# Altium schematic sheet IR-Detector.SchDoc
size A; SheetNumber: 15; SheetTotal: 15
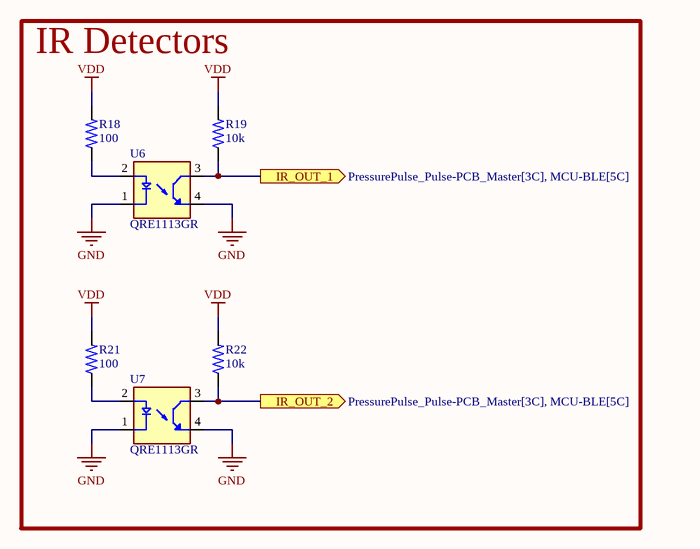
[diagram p0: IR-Detector.SchDoc]

## Parts
R18  value 100  [0402R]  (hidden comment: RES)
R19  value 10k  [0402R]  (hidden comment: RES)
R21  value 100  [0402R]  (hidden comment: RES)
R22  value 10k  [0402R]  (hidden comment: RES)
U6  QRE1113GR  [SMD-4P]
U7  QRE1113GR  [SMD-4P]

## Blocks framed on the sheet
IR Detectors: R18 R19 R21 R22 U6 U7

## Ports
IR_OUT_1 (out, see PressurePulse_Pulse-PCB_Master[3C], MCU-BLE[5C]), IR_OUT_2 (out, see PressurePulse_Pulse-PCB_Master[3C], MCU-BLE[5C])

## Nets
GND: U6.1(A) U6.4(ET) U7.1(A) U7.4(ET)
VDD: R18.2 R19.2 R21.2 R22.2
IR_OUT_1: R19.1 U6.3(CT) ; port IR_OUT_1
IR_OUT_2: R22.1 U7.3(CT) ; port IR_OUT_2
NetR18_1: R18.1 U6.2(C)
NetR21_1: R21.1 U7.2(C)

## Library data of the parts
R18 R19 R21 R22 = RES: Resistor; MFR PN: *; MFR: *; JLCPCB PN: *
U6 U7 = IR DETECTOR: Reflective Optical Sensor 0.039 (1mm) 4-SMD, Gull Wing; MFR: ON Semiconductor; JLCPCB PN: C232862; Value: QRE1113GR; MFR PN: QRE1113GR